# EAGLE design LM399_reference_board (EAGLE 7.2.0)
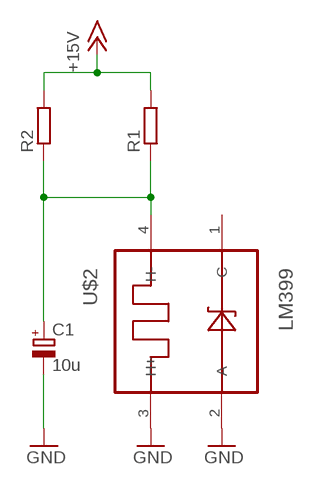
[diagram p0: schematic, sheet 1]

## Parts
C1  10u  CPOL-EUSMCD  [SMC_D]
R1  R-EU_R1206  [R1206]
R2  R-EU_0309/12  [0309/12]
U$2  LM399  [H4-TO46-4PIN]

## Nets
+15V: R1.2 R2.2
GND: C1.- U$2.2(A) U$2.3(H+)
N$5: C1.+ R1.1 R2.1 U$2.4(H-)
Unconnected: U$2.1(C)

## Library data of the parts
C1 = SquantorRCL:CPOL-EU: POLARIZED CAPACITOR, European symbol
R1 R2 = SquantorRCL:R-EU_: RESISTOR, European symbol
U$2 = SquantorLinearTechnology:LM399

## Board
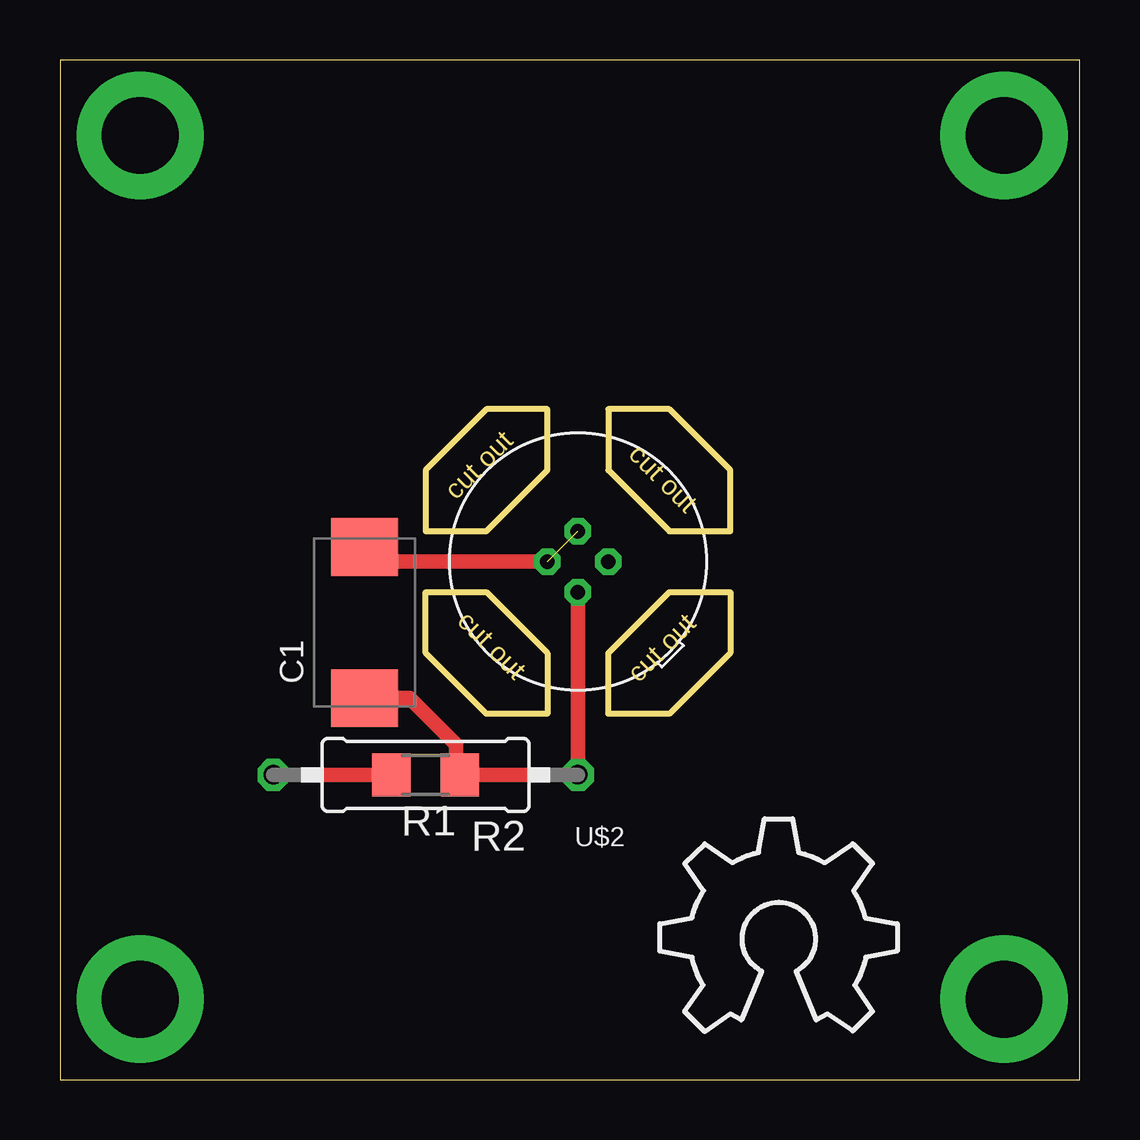
[diagram p1: board, top side]

Size 42.5 x 42.5 mm. Coordinates in mm from the lower left corner, seen from the top.
Outline: 0,0 42.5,0 42.5,42.5 0,42.5 0,0
Outline: 17.78,22.86 20.32,25.4 20.32,27.94 17.78,27.94 15.24,25.4 15.24,22.86 17.78,22.86
Outline: 22.86,27.94 22.86,25.4 25.4,22.86 27.94,22.86 27.94,25.4 25.4,27.94 22.86,27.94
Outline: 25.4,20.32 27.94,20.32 27.94,17.78 25.4,15.24 22.86,15.24 22.86,17.78 25.4,20.32
Outline: 15.24,20.32 17.78,20.32 20.32,17.78 20.32,15.24 17.78,15.24 15.24,17.78 15.24,20.32
Copper layers (1*16): Top 0.035mm / dielectric 1.5mm / Bottom 0.035mm
Design rules "default": minimum track width 10mil, minimum drill 24mil, track to track 8mil, track to pad 8mil, pad to pad 8mil, via to via 8mil, smd to smd 8mil, copper to edge 40mil, drill to drill 8mil, minimum pad ring 10mil, minimum via ring 8mil, stop-mask expansion 4mil, vias tented up to drill 0mil, thermal gap 10mil

### Footprints (pad centres in the part's own frame; a part is rotated, then mirrored left to right if it is on the bottom)
SMC_D = smd 2.4 x 2.8: + -3.15,0; - 3.15,0
R1206 = smd 1.6 x 1.803: 1 -1.422,0; 2 1.422,0
0309/12 = drill 0.813 octagon: 1 -6.35,0; 2 6.35,0
H4-TO46-4PIN = drill 0.6 octagon: 1 -1.27,0; 2 0,-1.27; 3 1.27,0; 4 0,1.27

### Placement (x,y rotation side)
C1  12.7,19.05 90 top
R1  15.24,12.7 180 top
R2  15.24,12.7 180 top
U$1  [OSHW_8X350_NOTEXT]  25,2 0 top
U$2  21.59,21.59 180 top

### Tracks (layer width: path | path; a pad name or v marks a point on that pad's centre or on a via)
+15V
  Top 0.61: R2.2 R1.2
GND  (1 unrouted)
  Top 0.61: U$2.3 13.31,21.59 C1.-
N$1  (via drill 3.2 pad 5.3)
  other vias: 3.35,3.35
N$2  (via drill 3.2 pad 5.3)
  other vias: 39.35,3.35
N$3  (via drill 3.2 pad 5.3)
  other vias: 39.35,39.35
N$4  (via drill 3.2 pad 5.3)
  other vias: 3.35,39.35
N$5
  Top 0.61: C1.+ 14.58,15.9 16.51,13.97 16.51,12.85 R1.1 R2.1 U$2.4

### Text on the board
Dimension: cut out | cut out | cut out | cut out